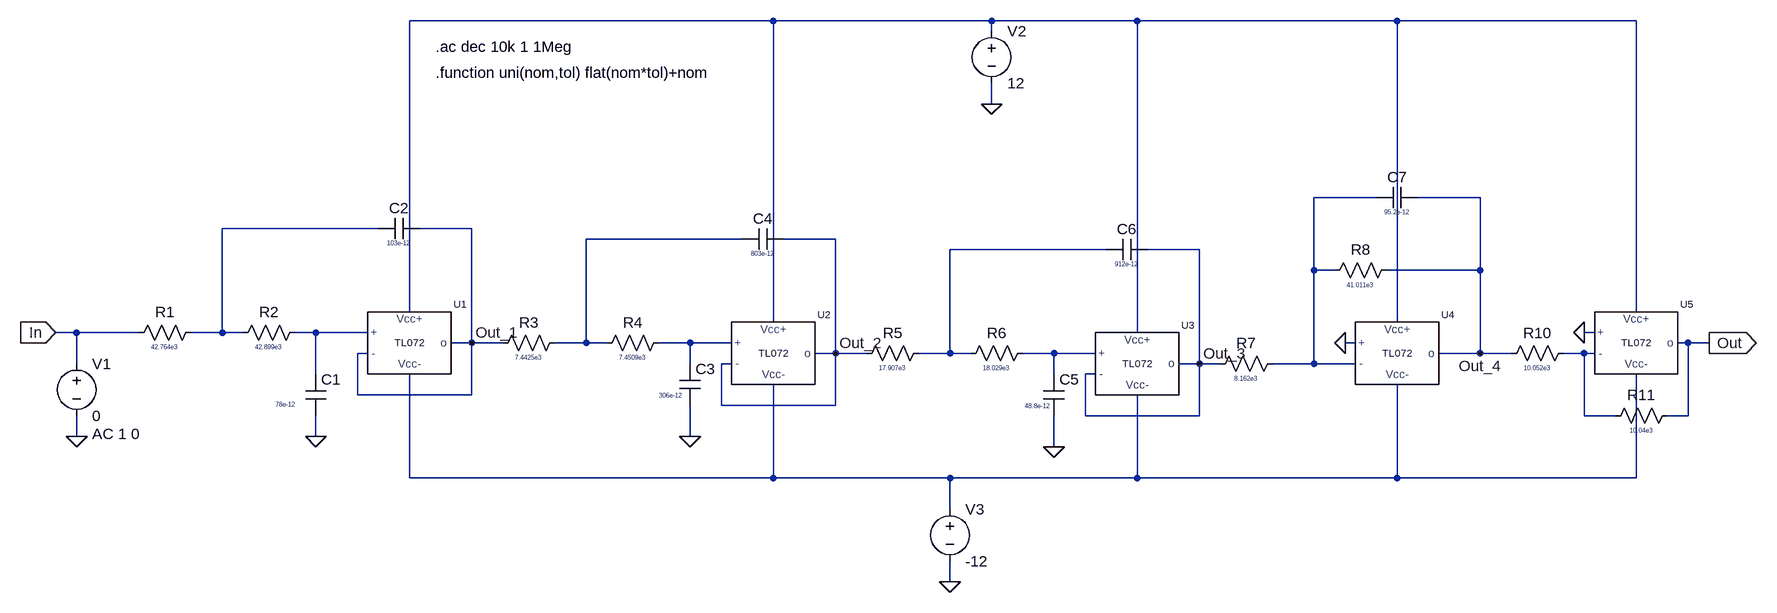
[diagram p0: schematic filter_real_values.asc]
filter_real_values.asc, the LTspice schematic file:
Version 4
SHEET 1 2628 696
WIRE 1040 -400 480 -400
WIRE 1376 -400 1040 -400
WIRE 1600 -400 1376 -400
WIRE 2000 -400 1600 -400
WIRE 2368 -400 2000 -400
WIRE 1376 -384 1376 -400
WIRE 1376 -272 1376 -304
WIRE 1968 -128 1872 -128
WIRE 2128 -128 2032 -128
WIRE 432 -80 192 -80
WIRE 576 -80 496 -80
WIRE 992 -64 752 -64
WIRE 1136 -64 1056 -64
WIRE 1552 -48 1312 -48
WIRE 1696 -48 1616 -48
WIRE 1872 -16 1872 -128
WIRE 1904 -16 1872 -16
WIRE 2128 -16 2128 -128
WIRE 2128 -16 1984 -16
WIRE 480 48 480 -400
WIRE 2368 48 2368 -400
WIRE 1040 64 1040 -400
WIRE 2000 64 2000 -400
WIRE -32 80 -64 80
WIRE 64 80 -32 80
WIRE 192 80 192 -80
WIRE 192 80 144 80
WIRE 224 80 192 80
WIRE 336 80 304 80
WIRE 416 80 336 80
WIRE 1600 80 1600 -400
WIRE 2304 80 2288 80
WIRE 576 96 576 -80
WIRE 576 96 544 96
WIRE 624 96 576 96
WIRE 752 96 752 -64
WIRE 752 96 704 96
WIRE 784 96 752 96
WIRE 912 96 864 96
WIRE 976 96 912 96
WIRE 1936 96 1920 96
WIRE 2448 96 2432 96
WIRE 2480 96 2448 96
WIRE 416 112 400 112
WIRE 1136 112 1136 -64
WIRE 1136 112 1104 112
WIRE 1184 112 1136 112
WIRE 1312 112 1312 -48
WIRE 1312 112 1264 112
WIRE 1344 112 1312 112
WIRE 1472 112 1424 112
WIRE 1536 112 1472 112
WIRE 2128 112 2128 -16
WIRE 2128 112 2064 112
WIRE 2176 112 2128 112
WIRE 2288 112 2256 112
WIRE 2304 112 2288 112
WIRE -32 128 -32 80
WIRE 912 128 912 96
WIRE 976 128 960 128
WIRE 1696 128 1696 -48
WIRE 1696 128 1664 128
WIRE 1728 128 1696 128
WIRE 1872 128 1872 -16
WIRE 1872 128 1808 128
WIRE 1936 128 1872 128
WIRE 336 144 336 80
WIRE 1472 144 1472 112
WIRE 1536 144 1520 144
WIRE 400 176 400 112
WIRE 576 176 576 96
WIRE 576 176 400 176
WIRE 960 192 960 128
WIRE 1136 192 1136 112
WIRE 1136 192 960 192
WIRE 1520 208 1520 144
WIRE 1696 208 1696 128
WIRE 1696 208 1520 208
WIRE 2288 208 2288 112
WIRE 2336 208 2288 208
WIRE 2448 208 2448 96
WIRE 2448 208 2416 208
WIRE -32 240 -32 208
WIRE 336 240 336 208
WIRE 912 240 912 192
WIRE 1472 256 1472 208
WIRE 480 304 480 144
WIRE 1040 304 1040 160
WIRE 1040 304 480 304
WIRE 1312 304 1040 304
WIRE 1600 304 1600 176
WIRE 1600 304 1312 304
WIRE 2000 304 2000 160
WIRE 2000 304 1600 304
WIRE 2368 304 2368 144
WIRE 2368 304 2000 304
WIRE 1312 352 1312 304
WIRE 1312 464 1312 432
FLAG 912 240 0
FLAG 1472 256 0
FLAG -32 240 0
FLAG -64 80 In
IOPIN -64 80 In
FLAG 1376 -272 0
FLAG 1312 464 0
FLAG 2288 80 0
FLAG 2480 96 Out
IOPIN 2480 96 Out
FLAG 1920 96 0
FLAG 336 240 0
FLAG 576 96 Out_1
FLAG 1136 112 Out_2
FLAG 1696 128 Out_3
FLAG 2128 112 Out_4
SYMBOL voltage -32 112 R0
WINDOW 123 24 124 Left 2
WINDOW 39 0 0 Left 0
SYMATTR Value2 AC 1 0
SYMATTR InstName V1
SYMATTR Value 0
SYMBOL res 160 64 R90
WINDOW 0 0 56 VBottom 2
WINDOW 3 32 56 VTop 0
SYMATTR InstName R1
SYMATTR Value 42.764e3
SYMBOL res 320 64 R90
WINDOW 0 0 56 VBottom 2
WINDOW 3 32 56 VTop 0
SYMATTR InstName R2
SYMATTR Value 42.899e3
SYMBOL cap 496 -96 R90
WINDOW 0 0 32 VBottom 2
WINDOW 3 32 32 VTop 0
SYMATTR InstName C2
SYMATTR Value 103e-12
SYMBOL res 720 80 R90
WINDOW 0 0 56 VBottom 2
WINDOW 3 32 56 VTop 0
SYMATTR InstName R3
SYMATTR Value 7.4425e3
SYMBOL res 880 80 R90
WINDOW 0 0 56 VBottom 2
WINDOW 3 32 56 VTop 0
SYMATTR InstName R4
SYMATTR Value 7.4509e3
SYMBOL cap 896 128 R0
WINDOW 3 -32 49 Left 0
SYMATTR Value 306e-12
SYMATTR InstName C3
SYMBOL cap 1056 -80 R90
WINDOW 0 0 32 VBottom 2
WINDOW 3 32 32 VTop 0
SYMATTR InstName C4
SYMATTR Value 803e-12
SYMBOL res 1280 96 R90
WINDOW 0 0 56 VBottom 2
WINDOW 3 32 56 VTop 0
SYMATTR InstName R5
SYMATTR Value 17.907e3
SYMBOL res 1440 96 R90
WINDOW 0 0 56 VBottom 2
WINDOW 3 32 56 VTop 0
SYMATTR InstName R6
SYMATTR Value 18.029e3
SYMBOL cap 1456 144 R0
WINDOW 3 -29 49 Left 0
SYMATTR Value 48.8e-12
SYMATTR InstName C5
SYMBOL cap 1616 -64 R90
WINDOW 0 0 32 VBottom 2
WINDOW 3 32 32 VTop 0
SYMATTR InstName C6
SYMATTR Value 912e-12
SYMBOL res 1824 112 R90
WINDOW 0 0 56 VBottom 2
WINDOW 3 32 56 VTop 0
SYMATTR InstName R7
SYMATTR Value 8.162e3
SYMBOL res 2000 -32 R90
WINDOW 0 0 56 VBottom 2
WINDOW 3 32 56 VTop 0
SYMATTR InstName R8
SYMATTR Value 41.011e3
SYMBOL cap 2032 -144 R90
WINDOW 0 0 32 VBottom 2
WINDOW 3 32 32 VTop 0
SYMATTR InstName C7
SYMATTR Value 95.2e-12
SYMBOL res 2272 96 R90
WINDOW 0 0 56 VBottom 2
WINDOW 3 32 56 VTop 0
SYMATTR InstName R10
SYMATTR Value 10.052e3
SYMBOL voltage 1376 -400 R0
WINDOW 123 0 0 Left 0
WINDOW 39 0 0 Left 0
SYMATTR InstName V2
SYMATTR Value 12
SYMBOL voltage 1312 336 R0
WINDOW 123 0 0 Left 0
WINDOW 39 0 0 Left 0
SYMATTR InstName V3
SYMATTR Value -12
SYMBOL res 2432 192 R90
WINDOW 0 0 56 VBottom 2
WINDOW 3 32 56 VTop 0
SYMATTR InstName R11
SYMATTR Value 10.04e3
SYMBOL TL072 352 96 R0
SYMATTR InstName U1
SYMBOL TL072 912 112 R0
SYMATTR InstName U2
SYMBOL TL072 1472 128 R0
SYMATTR InstName U3
SYMBOL TL072 1872 112 R0
SYMATTR InstName U4
SYMBOL TL072 2240 96 R0
SYMATTR InstName U5
SYMBOL cap 320 144 R0
WINDOW 3 -46 47 Left 0
SYMATTR Value 78e-12
SYMATTR InstName C1
TEXT 520 -360 Left 2 !.ac dec 10k 1 1Meg
TEXT 520 -320 Left 2 !.function uni(nom,tol) flat(nom*tol)+nom

The netlist it stands for:
* filter_real_values.asc
V1 In 0 0 AC 1 0
R1 N003 In 42.764e3
R2 N006 N003 42.899e3
C2 Out_1 N003 103e-12
R3 N004 Out_1 7.4425e3
R4 N007 N004 7.4509e3
C3 N007 0 306e-12
C4 Out_2 N004 803e-12
R5 N005 Out_2 17.907e3
R6 N008 N005 18.029e3
C5 N008 0 48.8e-12
C6 Out_3 N005 912e-12
R7 N002 Out_3 8.162e3
R8 Out_4 N002 41.011e3
C7 Out_4 N002 95.2e-12
R10 N009 Out_4 10.052e3
V2 N001 0 12
V3 N010 0 -12
R11 Out N009 10.04e3
XU1 N006 Out_1 N001 N010 Out_1 TL072  ; pins + - Vcc+ Vcc- o
XU2 N007 Out_2 N001 N010 Out_2 TL072  ; pins + - Vcc+ Vcc- o
XU3 N008 Out_3 N001 N010 Out_3 TL072  ; pins + - Vcc+ Vcc- o
XU4 0 N002 N001 N010 Out_4 TL072  ; pins + - Vcc+ Vcc- o
XU5 0 N009 N001 N010 Out TL072  ; pins + - Vcc+ Vcc- o
C1 N006 0 78e-12
.ac dec 10k 1 1Meg
.function uni(nom,tol) flat(nom*tol)+nom
.lib C:\Users\ricig\Desktop\Lavoro\LTspice\custom\TL072.sub
.backanno
.end